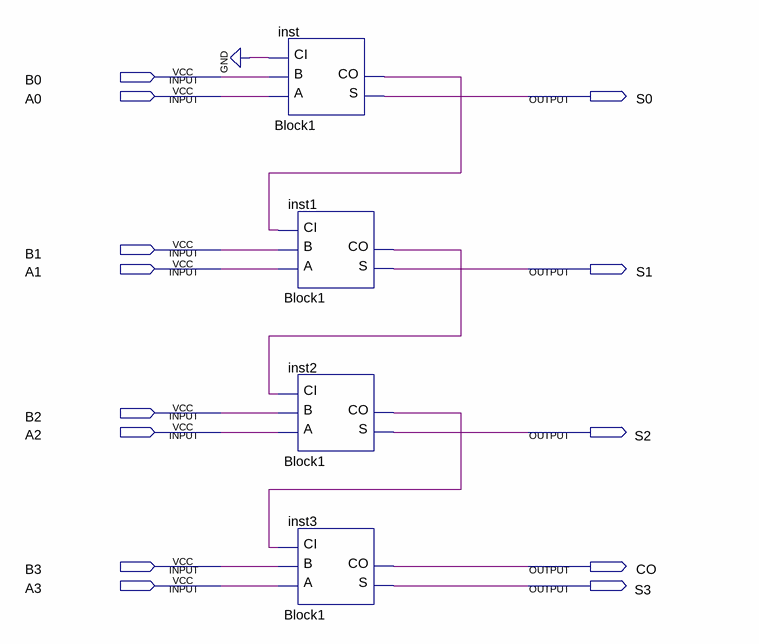
[diagram p0: schematic sheet]
// Quartus schematic Add4Bin.bdf as structural Verilog: 4 symbols, 13 pins
module Add4Bin (
  input  B0,
  input  A0,
  input  B1,
  input  A1,
  input  B2,
  input  A2,
  input  B3,
  input  A3,
  output S0,
  output S1,
  output S2,
  output CO,
  output S3
);

  wire inst1_co, inst2_co, inst_co;

  Block1 inst (.A(A0), .B(B0), .CI(1'b0), .S(S0), .CO(inst_co));
  Block1 inst1 (.A(A1), .B(B1), .CI(inst_co), .S(S1), .CO(inst1_co));
  Block1 inst2 (.A(A2), .B(B2), .CI(inst1_co), .S(S2), .CO(inst2_co));
  Block1 inst3 (.A(A3), .B(B3), .CI(inst2_co), .S(S3), .CO(CO));
endmodule
